# Altium schematic sheet STM8.SchDoc
size A4; SheetNumber: 8; SheetTotal: 8; SPICEModelCacheLETLOLHH: <root> / <DocumentId>LETLOLHH</DocumentId> / <CacheFrame Number="0"> / <Model Name="led0" Kind="MDL"> / <Text>*Typ INFRARED GaAs LED: Vf=1.2V Vr=5V If=40mA trr=3uS / *LED Pinout: 1=A, 2=K / .MODEL LED0 D (IS=93.5P RS=84M N=2.63 BV=5 IBV=10U / + CJO=2.97P VJ=.75 M=.333 TT=4.32U)</Text> / </Model> / </CacheFrame> / </root>
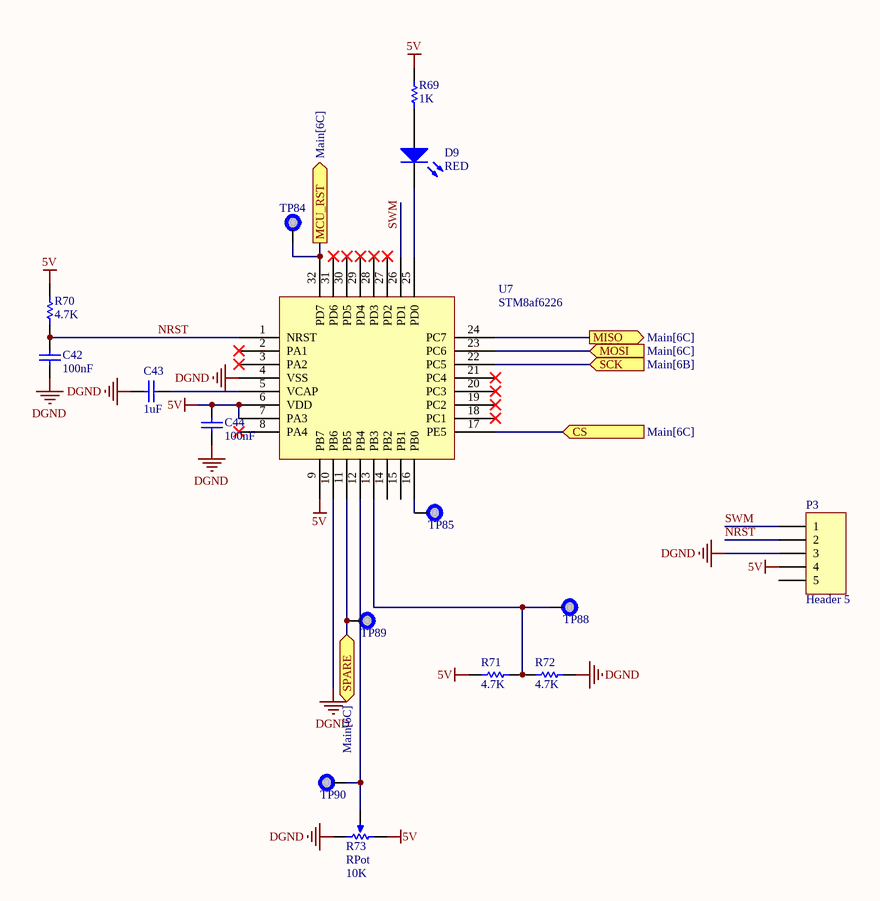
[diagram p0: STM8.SchDoc]

## Parts
C42  100nF  [0603c]
C43  1uF  [0805c]
C44  100nF  [0603c]
D9  RED  [0805LED]
P3  Header 5  [HDR1X5]
R69  1K  [0805]
R70  4.7K  [0805]
R71  4.7K  [0805]
R72  4.7K  [0805]
R73  RPot  value 10K  [POT-MULTITURN]
TP84  TestPoint  [TP]  (value not drawn)
TP85  TestPoint  [TP]  (value not drawn)
TP88  TestPoint  [TP]  (value not drawn)
TP89  TestPoint  [TP]  (value not drawn)
TP90  TestPoint  [TP]  (value not drawn)
U7  STM8af6226  [LQFP-32]

## Ports
CS (in, see Main[6C]), MCU_RST (out, see Main[6C]), MISO (out, see Main[6C]), MOSI (in, see Main[6C]), SCK (in, see Main[6B]), SPARE (bidir, see Main[6C])

## Nets
5V: C44.1 P3.4 R69.2 R70.1 R71.2 R73.1(TOP) U7.6(VDD) U7.7(PA3) U7.9(PB7)
DGND: C42.2 C43.2 C44.2 P3.3 R72.1 R73.3(BOT) U7.4(VSS) U7.10(PB6)
CS: U7.17(PE5) ; port CS
MCU_RST: TP84.1 U7.32(PD7) ; port MCU_RST
MISO: U7.24(PC7) ; port MISO
MOSI: U7.23(PC6) ; port MOSI
NRST: C42.1 P3.2 R70.2 U7.1(NRST)
SCK: U7.22(PC5) ; port SCK
SPARE: TP89.1 U7.11(PB5) ; port SPARE
SWM: P3.1 U7.26(PD1)
NetC43_1: C43.1 U7.5(VCAP)
NetD9_1: D9.1(A) R69.1
NetD9_2: D9.2(K) U7.25(PD0)
NetR71_1: R71.1 R72.2 TP88.1 U7.13(PB3)
NetR73_2: R73.2(TAP) TP90.1 U7.12(PB4)
NetTP85_1: TP85.1 U7.16(PB0)

Not connected (* = marked no-connect by the designer): P3 5; U7 2(PA1)* 3(PA2)* 8(PA4)* 14(PB2) 15(PB1) 18(PC1)* 19(PC2)* 20(PC3)* 21(PC4)* 27(PD2)* 28(PD3)* 29(PD4)* 30(PD5)* 31(PD6)*

## Library data of the parts
C42-C44 = Cap: LOW ESR; Published: 8-Jun-2000; LatestRevisionDate: 17-Jul-2002; LatestRevisionNote: Re-released for DXP Platform.; PackageReference: RAD-0.3; Publisher: Altium Limited; PackageDescription: Radial Cap, Thru-Hole; 2 Leads; 0.3 in Pin Spacing
  C42 C44: Value: 100nF
  C43: Value: 1uF
D9 = LED0: Published: 8-Jun-2000; LatestRevisionDate: 08-Jul-2005; LatestRevisionNote: Mech Layer 1 removed.; PackageReference: LED-0; Publisher: Altium Limited; PackageDescription: LED; 2 Leads
P3 = Header 5: Header, 5-Pin; LatestRevisionDate: 17-Jul-2002; LatestRevisionNote: Re-released for DXP Platform.; Publisher: Altium Limited
R69-R72 = Res1: Resistor; Published: 8-Jun-2000; LatestRevisionDate: 17-Jul-2002; LatestRevisionNote: Re-released for DXP Platform.; PackageReference: AXIAL-0.3; Publisher: Altium Limited; PackageDescription: Axial Device, Thru-Hole; 2 Leads; 0.3 in Pin Spacing
  R69: Value: 1K
  R70-R72: Value: 4.7K
R73 = RPot: MultiTurn; Sim Note: Enter the Resistance value and the set point into parameter fields.; Set Position: 0.5; Published: 8-Jun-2000; LatestRevisionDate: 17-Jul-2002; LatestRevisionNote: Re-released for DXP Platform.; PackageReference: VR5; Publisher: Altium Limited; PackageDescription: Variable Resistor, Thru-Hole; 3 Leads